# Altium schematic sheet SENSORS.SchDoc
size A3; DocumentNumber: 5; SheetNumber: 5; SheetTotal: 5
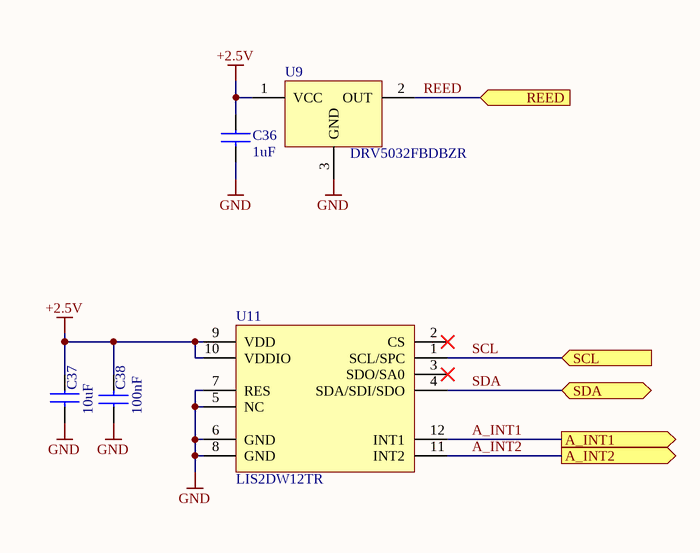
[diagram p0: SENSORS.SchDoc]

## Parts
C36  1uF  [CAP0402]
C37  10uF  [CAP0603]
C38  100nF  [CAP0402]
U9  DRV5032FBDBZR  [SOT23-3AL]
U11  LIS2DW12TR  [LGA-12]

## Ports
A_INT1 (out), A_INT2 (out), REED (in), SCL (in), SDA (bidir)

## Nets
+2.5V: C36.1 C37.1 C38.2 U9.1(VCC) U11.9(VDD) U11.10(VDDIO)
GND: C36.2 C37.2 C38.1 U9.3(GND) U11.5(NC) U11.6(GND) U11.7(RES) U11.8(GND)
A_INT1: U11.12(INT1) ; port A_INT1
A_INT2: U11.11(INT2) ; port A_INT2
REED: U9.2(OUT) ; port REED
SCL: U11.1(SCL/SPC) ; port SCL
SDA: U11.4(SDA/SDI/SDO) ; port SDA

Not connected (* = marked no-connect by the designer): U11 2(CS)* 3(SDO/SA0)*

## Notes on the sheet
- Size: A3
- Revision:
- Sheet
- of

## Library data of the parts
C36 = C - 1uF/0402: CAP CER 1UF 10V 20% X5R 0402; Manufacturer: Murata; Manufacturer Part Number: GRM155R61A105ME15D; IRNAS Part No.: /; Stock 1: 0; Pricing 1: 10=0.0379, 100=0.0266, 500=0.0156, 2500=0.0098, 5000=0.0083 (EUR); Mount: Surface Mount; Case/Package: 0402; Case Code (Metric): 1005; Case Code (Imperial): 0402; Min Operating Temperature: -55°C; Max Operating Temperature: 85°C; Capacitance: 1uF; Tolerance: 20%; Voltage Rating: 10V; Packaging: Tape and Reel; Package Quantity: 1; Dielectric: X5R; Voltage: 10V; Voltage Rating (DC): 10V; Length: 1mm; Height: 0.5mm; Width: 0.02inch; Thickness: 0.022inch; Depth: 0.5mm; Radiation Hardening: No; REACH SVHC: No SVHC; Lead Free: Lead Free; ComponentLink1URL: https://datasheet.ciiva.com/164/product-164665.pdf; ComponentLink1Description: https://datasheet.ciiva.com/164/product-164665.pdf; ComponentLink2URL: https://datasheet.ciiva.com/11616/product-11616508.pdf; ComponentLink2Description: https://datasheet.ciiva.com/11616/product-11616508.pdf; ComponentLink3URL: https://datasheet.ciiva.com/46418/1769893-46418047.pdf; ComponentLink3Description: https://datasheet.ciiva.com/46418/1769893-46418047.pdf; ComponentLink4URL: https://datasheet.ciiva.com/164/partnumbering-e-01-164666.pdf; ComponentLink4Description: https://datasheet.ciiva.com/164/partnumbering-e-01-164666.pdf; ComponentLink5URL: https://datasheet.ciiva.com/164/partnumbering-e-01-164667.pdf; ComponentLink5Description: https://datasheet.ciiva.com/164/partnumbering-e-01-164667.pdf; Supplier 1: Farnell; Supplier Part Number 1: 1740588
C37 = C - 10uF/10V: Cap Ceramic 10uF 10V X5R 10% SMD 0603 85C Paper T/R; Manufacturer: Samsung; Manufacturer Part Number: CL10A106KP8NNNC; IRNAS Part No.: /; Stock 1: 2844657; Pricing 1: 1=0.36, 10=0.248, 100=0.1403, 500=0.099, 1000=0.08663 (USD); Mount: Surface Mount; Case/Package: 0603; Case Code (Metric): 1608; Case Code (Imperial): 0603; Material: Ceramic; Contact Plating: Tin; Min Operating Temperature: -55°C; Max Operating Temperature: 85°C; Capacitance: 10uF; Tolerance: 10%; Package Quantity: 1; Packaging: Tape and Reel; Voltage Rating: 10V; Dielectric: X5R; Voltage Rating (DC): 10V; Length: 1.6mm; Height: 0.8mm; Width: 0.031inch; Thickness: 0.035inch; Depth: 0.8mm; Radiation Hardening: No; Lead Free: Lead Free; ComponentLink1URL: https://www.verical.com/server-webapp/html/getDatasheet?partID=359551; ComponentLink1Description: https://www.verical.com/server-webapp/html/getDatasheet?partID=359551; ComponentLink2URL: http://www1.futureelectronics.com/doc/SAMSUNG%20PASSIVE/CL05B104KQ5NNNC.pdf; ComponentLink2Description: http://www1.futureelectronics.com/doc/SAMSUNG%20PASSIVE/CL05B104KQ5NNNC.pdf; ComponentLink3URL: https://produktinfo.conrad.com/datenblaetter/450000-474999/457369-da-01-en-VS_KONDENSATOR_0603.pdf; ComponentLink3Description: https://produktinfo.conrad.com/datenblaetter/450000-474999/457369-da-01-en-VS_KONDENSATOR_0603.pdf; Supplier 1: Farnell; Supplier Part Number 1: 2456110
C38 = C - 100nF/0402: MULTICOMP         MC0402X104J160CT             SMD Multilayer Ceramic Capacitor, 0402 [1005 Metric], 0.1 F, 16 V,  5%, X5R, MC Series                          New; IRNAS Part No.: /; Voltage Rating: 16V; Supplier 1: Farnell; Manufacturer: Multicomp; Manufacturer Part Number: MC0402X104J160CT; Stock 1: 3230; Pricing 1: 10=0.0139, 100=0.0108, 500=0.0076, 2500=0.0051, 5000=0.0038 (EUR); Case Code (Metric): 1005; Case Code (Imperial): 0402; Min Operating Temperature: -55°C; Max Operating Temperature: 85°C; Capacitance: 100nF; Dielectric: X5R; Packaging: Tape and Reel; Tolerance: 5%; Voltage Rating (DC): 16V; REACH SVHC: No SVHC; ComponentLink1URL: http://www.farnell.com/datasheets/2117933.pdf; ComponentLink1Description: http://www.farnell.com/datasheets/2117933.pdf; ComponentLink2URL: http://www.farnell.com/datasheets/2117900.pdf; ComponentLink2Description: http://www.farnell.com/datasheets/2117900.pdf; Supplier Part Number 1: 2627419
U9 = SEN - DRV5032FBDBZR: Board Mount Hall Effect/Magnetic Sensors LP HALL 32FBDBZR; Manufacturer: TDK InvenSense; Interface: I2C; Sensor Type: Accelerometer; Max Supply Voltage: 3.6V; Min Supply Voltage: 2.4V; Output Type: SPI; Manufacturer Part Number: MPU-9250; Stock 1: 0; RoHS: Yes; Mount: Surface Mount; Case/Package: QFN; Number of Pins: 24; Min Operating Temperature: -40°C; Max Operating Temperature: 85°C; Package Quantity: 1; Length: 3.1mm; Height: 1mm; Width: 3.1mm; ComponentLink1Description: Datasheet; ComponentLink1URL: http://www.ti.com/general/docs/suppproductinfo.tsp?distId=26&gotoUrl=http%3A%2F%2Fwww.ti.com%2Flit%2Fgpn%2Fdrv5032; Supplier 1: Mouser; Supplier Part Number 1: 595-DRV5032FBDBZR
U11 = SEN - LIS2DW12TR: MEMS Accelerometer, Digital, X, Y, Z, ± 2g, ± 4g, ± 8g, ± 16g, 1.62 V, 3.6 V; Manufacturer: TDK InvenSense; Interface: I2C; Max Supply Voltage: 3.6V; Min Supply Voltage: 2.4V; Output Type: SPI; Manufacturer Part Number: MPU-9250; Stock 1: 0; RoHS: Yes; Mount: Surface Mount; Case/Package: QFN; Number of Pins: 24; Min Operating Temperature: -40°C; Max Operating Temperature: 85°C; Package Quantity: 1; Sensor Type: Accelerometer; Length: 3.1mm; Height: 1mm; Width: 3.1mm; ComponentLink1Description: Datasheet; ComponentLink1URL: D:\altium\Altium_Library\Active\Datasheet\LIS2DW12TR.pdf; Supplier 1: Farnell; Supplier Part Number 1: 2849615